# EasyEDA Pro project ProProject_开关电源实验平台_2024-07-17.epro, board PCB7
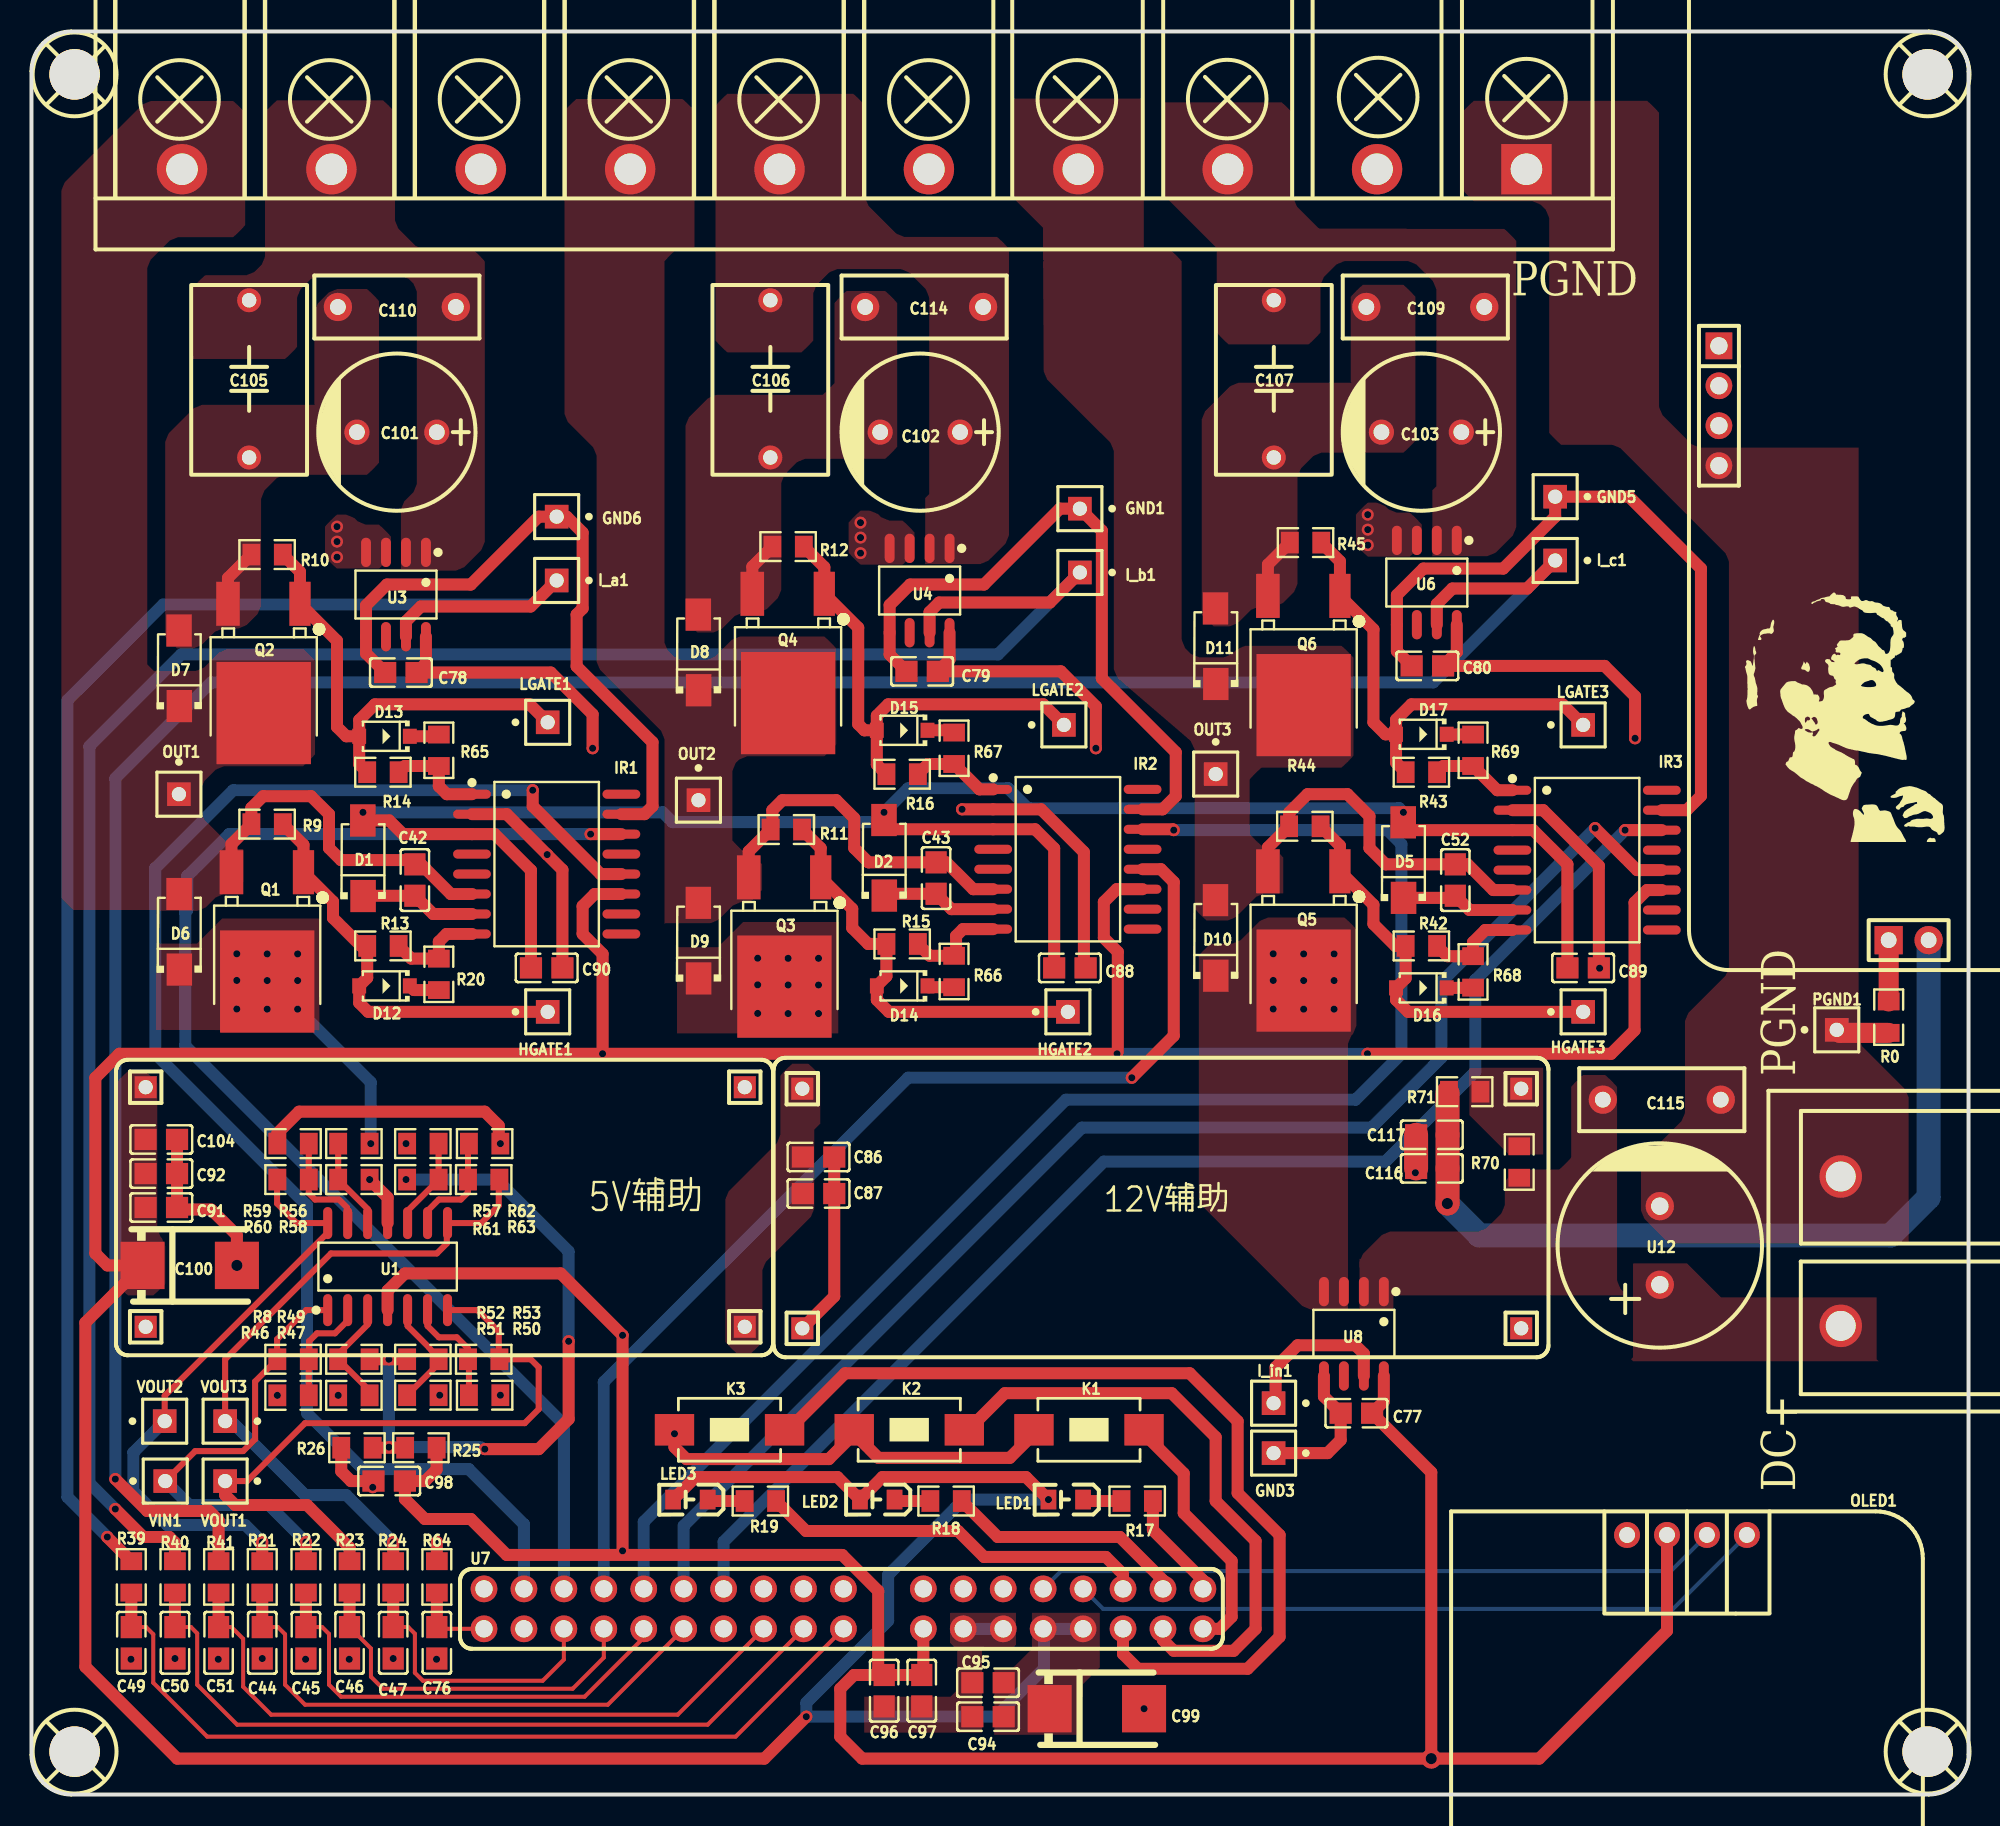
[diagram p0: board, top side]
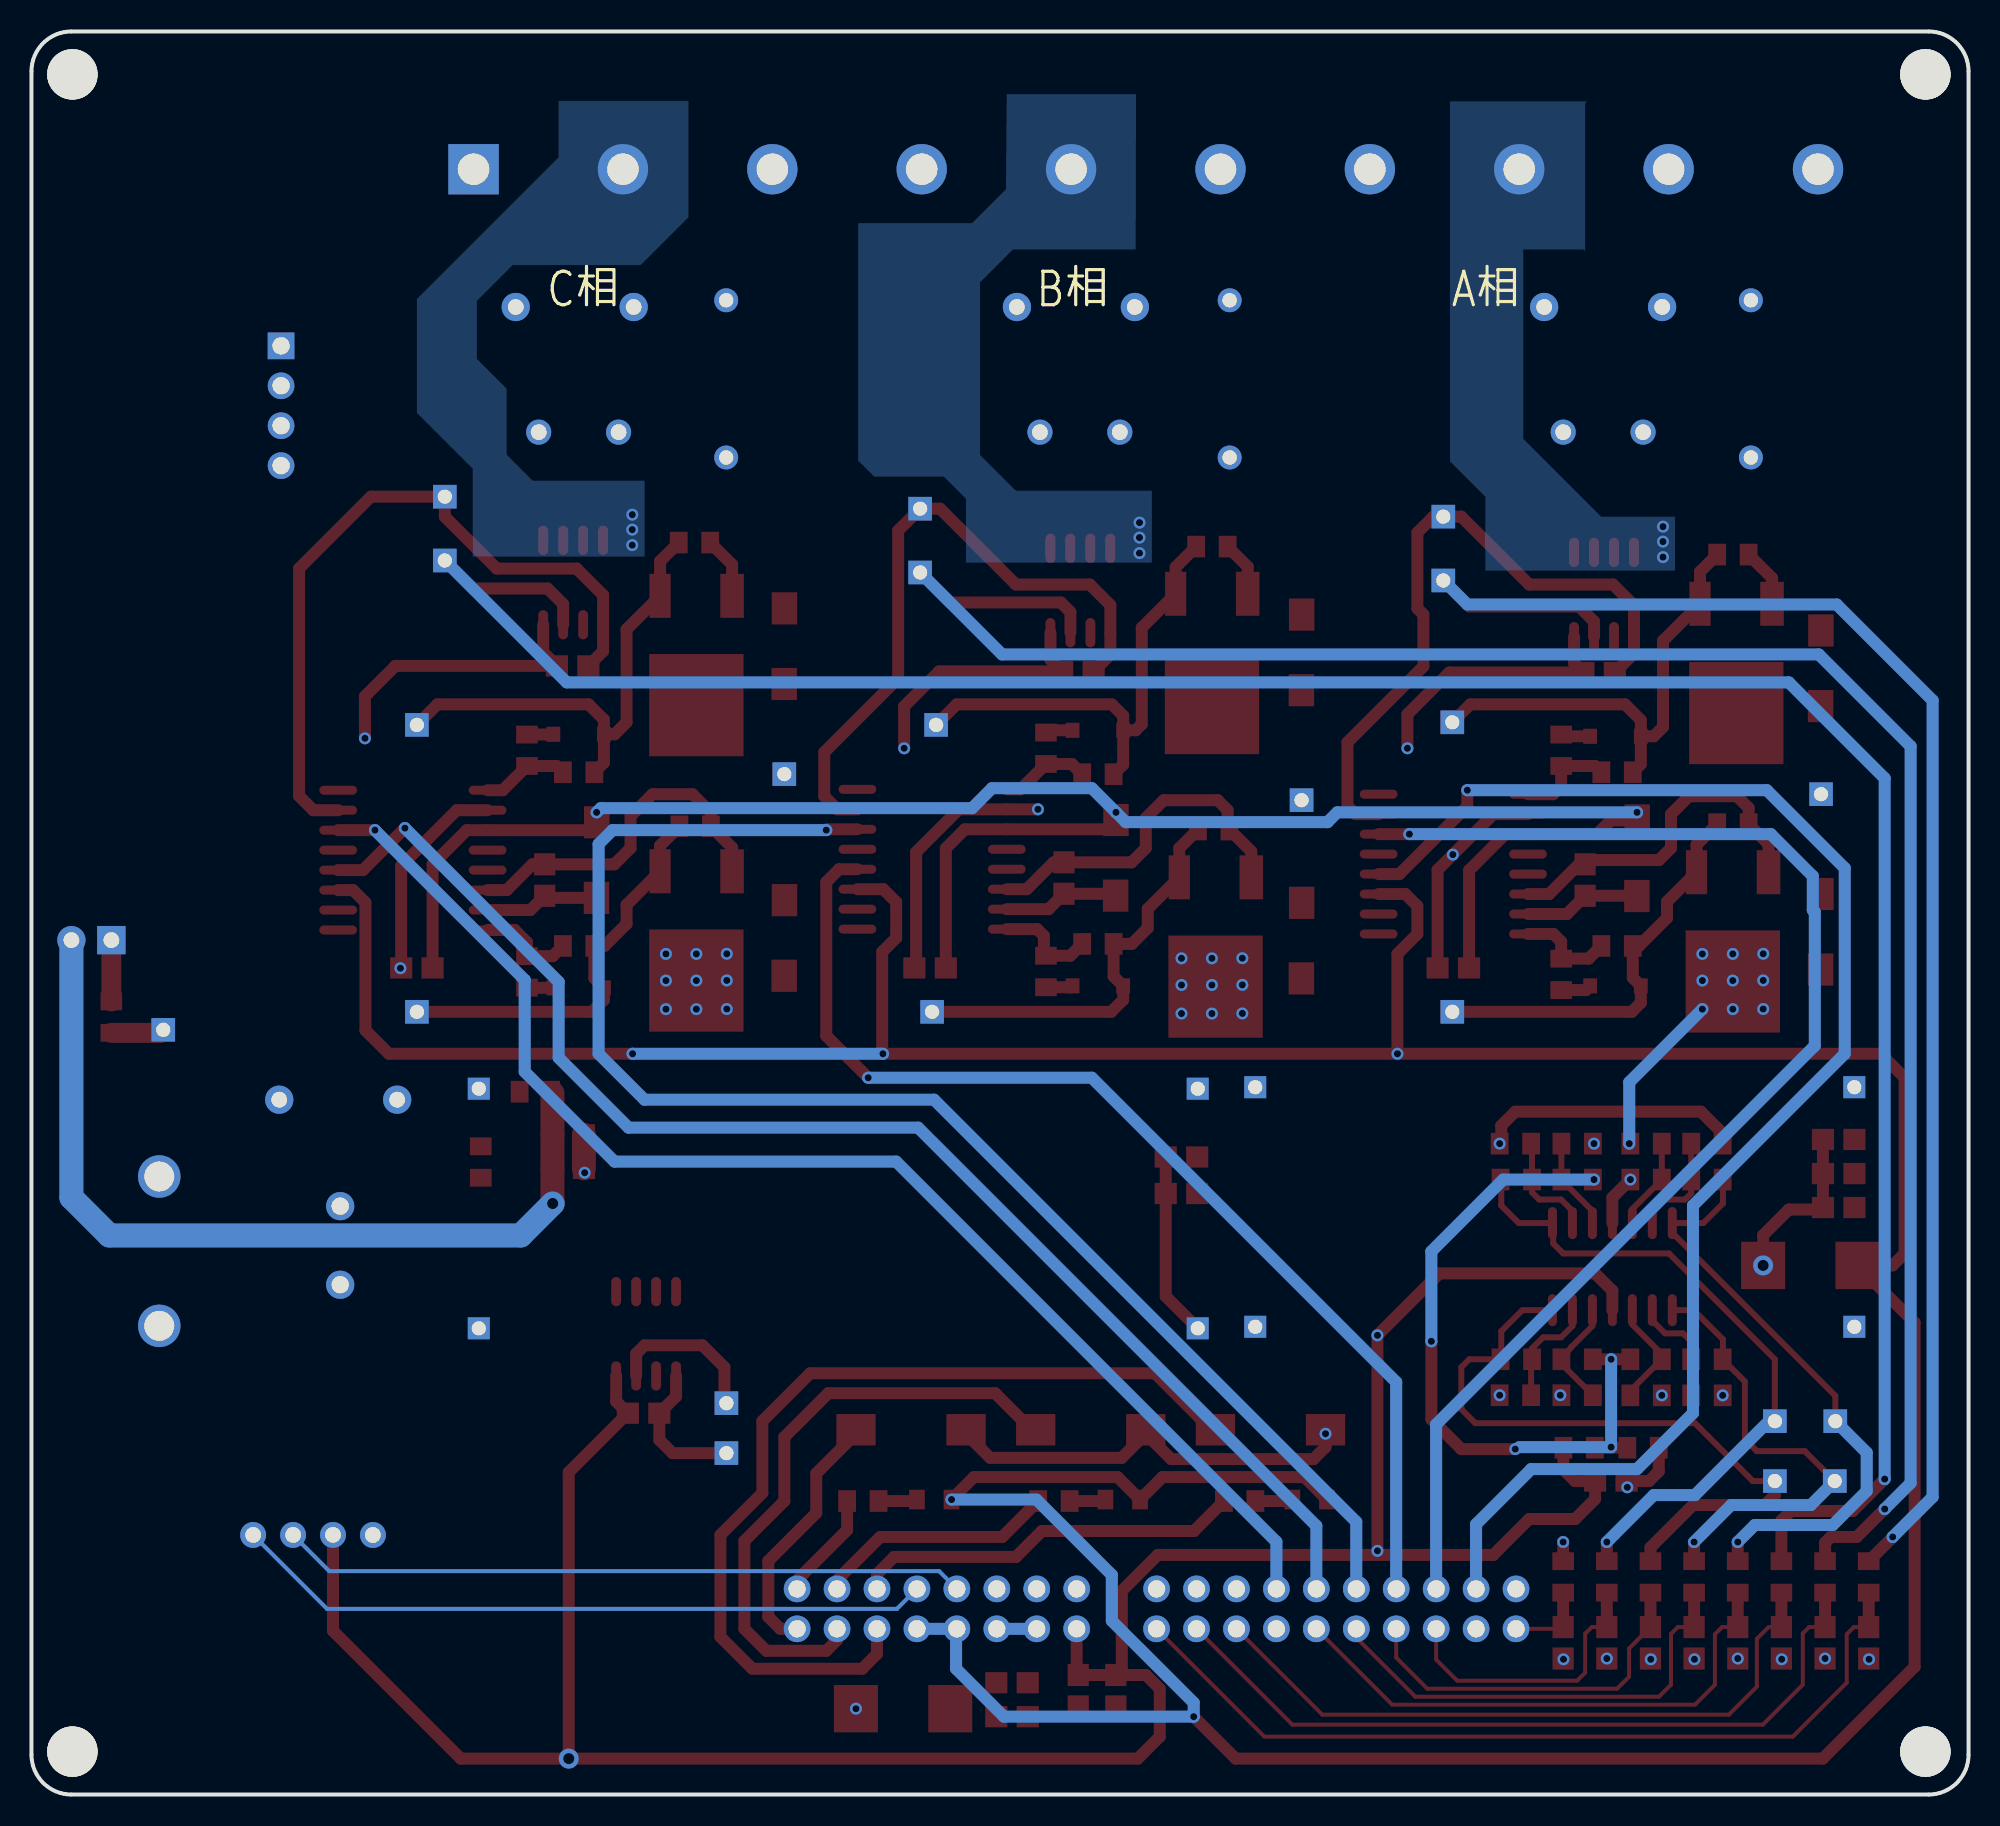
[diagram p1: board, bottom side, seen from below]

Outline 123.19 x 112.14 mm; copper layers: Top Layer, GND1, Inner2, PGND, GND, Bottom Layer. Coordinates in mm from the lower left corner of the outline.
Outline path: 0,109.6 0,2.54 arc(0.74,0.74) 2.54,0 120.65,0 arc(122.45,0.74) 123.19,2.54 123.19,109.6 arc(122.45,111.4) 120.65,112.14 2.54,112.14 arc(0.74,111.4) 0,109.6
Stack: Top Layer 0.035mm 外层铜厚1oz / Dielectric1 0.0994mm 3313 RC57% 4.2mil / GND1 0.0152mm 内层铜厚 / Dielectric2 0.55mm 0.55mm H/H不含铜 / Inner2 0.0152mm 内层铜厚 / Dielectric3 0.1088mm 2116 RC54% 4.9mil / PGND 0.0152mm 内层铜厚 / Dielectric4 0.55mm 0.55mm H/H不含铜 / GND 0.0152mm 内层铜厚 / Dielectric5 0.0994mm 3313 RC57% 4.2mil / Bottom Layer 0.035mm 外层铜厚1oz

## Design rules (mm)
template: JLCPCB Capability(Two Layers Board)
spacing copperThickness1oz (default): track to track 0.102, other pairs 0.152 to 0.3
spacing copperThickness2oz: track to track 0.203, other pairs 0.152 to 0.3
track width copperThickness1oz (default): min 0.127, default 0.254, max 2.54
track width copperThickness2oz: min 0.203, default 0.254, max 2.54
differential pair differentialPair (default): width min 0.127, default 0.254, max 2.54; gap min 0.152, default 0.152
via viaSize (default): diameter min 0.5, default 0.61, max 10; hole min 0.3, default 0.305, max 6.3

## Placement (name value [footprint] x y rotation side)
12V辅助  -  [12V辅助电源-LM5164]  72.52 38.29 180 top
C42  10uF  [c0805]  24.38 58.17 90 top
C43  10uF  [c0805]  57.53 58.29 90 top
C44  10nF  [c0805]  14.68 9.65 90 top
C45  10nF  [c0805]  17.45 9.65 90 top
C46  10nF  [c0805]  20.23 9.65 90 top
C47  10nF  [c0805]  23 9.65 90 top
C49  10nF  [c0805]  6.35 9.65 90 top
C50  10nF  [c0805]  9.13 9.65 90 top
C51  10nF  [c0805]  11.9 9.65 90 top
C52  10uF  [c0805]  90.55 58.17 90 top
C76  10nF  [c0805]  25.78 9.65 90 top
C77  100nF  [C0805]  84.26 24.26 0 top
C78  100nF  [C0805]  23.49 71.37 0 top
C79  100nF  [C0805]  56.64 71.44 0 top
C80  100nF  [C0805]  88.77 71.79 0 top
C86  100nF  [c0805]  50.05 40.55 180 top
C87  100nF  [c0805]  50.05 38.23 180 top
C88  100nF  [c0805]  66.04 52.58 180 top
C89  100nF  [c0805]  98.68 52.58 180 top
C90  100nF  [c0805]  32.77 52.58 180 top
C91  100nF  [c0805]  8.26 37.34 180 top
C92  100nF  [c0805]  8.26 39.5 180 top
C94  100nF  [c0805]  60.83 4.95 0 top
C95  100nF  [c0805]  60.83 7.11 0 top
C96  100nF  [c0805]  54.23 6.6 90 top
C97  100nF  [c0805]  56.62 6.6 90 top
C98  100nF  [c0805]  22.75 19.94 0 top
C99  22uF  [CASE-D_7343]  67.76 5.46 180 top
C100  22uF  [CASE-D_7343]  10.06 33.66 180 top
C101  220uF  [CAP-TH_BD10.0-P5.00-D1.0-FD]  23.24 86.66 180 top
C102  220uF  [CAP-TH_BD10.0-P5.00-D1.0-FD]  56.51 86.66 180 top
C103  220uF  [CAP-TH_BD10.0-P5.00-D1.0-FD]  88.39 86.66 180 top
C104  100nF  [c0805]  8.26 41.67 180 top
C105  1uF  [CAP-TH_L12.0-W7.1-P10.00-D0.6]  13.84 90.04 270 top
C106  1uF  [CAP-TH_L12.0-W7.1-P10.00-D0.6]  46.99 90.04 270 top
C107  1uF  [CAP-TH_L12.0-W7.1-P10.00-D0.6]  79.01 90.04 270 top
C109  100nF  [CAP-TH_L10.0-W4.0-P7.50-D0.8]  88.64 94.61 0 top
C110  100nF  [CAP-TH_L10.0-W4.0-P7.50-D0.8]  23.24 94.61 0 top
C114  100nF  [CAP-TH_L10.0-W4.0-P7.50-D0.8]  56.77 94.61 0 top
C115  100nF  [CAP-TH_L10.0-W4.0-P7.50-D0.8]  103.68 44.2 180 top
C116  100nF  [C0805]  89.06 39.83 0 top
C117  100nF  [C0805]  89.06 41.96 0 top
D1  SS510  [SMA_L4.3-W2.6-LS5.0-RD]  21.08 59.55 90 top
D2  SS510  [SMA_L4.3-W2.6-LS5.0-RD]  54.23 59.58 90 top
D5  SS510  [SMA_L4.3-W2.6-LS5.0-RD]  87.25 59.44 90 top
D6  SS510  [SMA_L4.3-W2.6-LS5.0-RD]  9.4 54.88 90 top
D7  SS510  [SMA_L4.3-W2.6-LS5.0-RD]  9.4 71.64 90 top
D8  SS510  [SMA_L4.3-W2.6-LS5.0-RD]  42.42 72.64 90 top
D9  SS510  [SMA_L4.3-W2.6-LS5.0-RD]  42.42 54.31 90 top
D10  SS510  [SMA_L4.3-W2.6-LS5.0-RD]  75.31 54.48 90 top
D11  SS510  [SMA_L4.3-W2.6-LS5.0-RD]  75.31 73.04 90 top
D12  1N4148W  [SOD-123_L2.7-W1.6-LS3.7-FD]  22.45 51.43 0 top
D13  1N4148W  [SOD-123_L2.7-W1.6-LS3.7-FD]  22.45 67.31 0 top
D14  1N4148W  [SOD-123_L2.7-W1.6-LS3.7-FD]  55.37 51.43 0 top
D15  1N4148W  [SOD-123_L2.7-W1.6-LS3.7-FD]  55.37 67.69 0 top
D16  1N4148W  [SOD-123_L2.7-W1.6-LS3.7-FD]  88.39 51.31 0 top
D17  1N4148W  [SOD-123_L2.7-W1.6-LS3.7-FD]  88.39 67.44 0 top
GND1  -  [hdr1x1]  66.67 81.79 270 top
GND3  -  [hdr1x1]  78.99 21.72 270 top
GND5  -  [hdr1x1]  96.9 82.55 270 top
GND6  -  [hdr1x1]  33.4 81.28 270 top
HGATE1  -  [hdr1x1]  32.83 49.78 90 top
HGATE2  -  [hdr1x1]  65.91 49.78 90 top
HGATE3  -  [hdr1x1]  98.68 49.78 90 top
I_a1  -  [hdr1x1]  33.4 77.22 270 top
I_b1  -  [hdr1x1]  66.67 77.73 270 top
I_c1  -  [hdr1x1]  96.9 78.49 270 top
I_in1  -  [hdr1x1]  78.99 24.89 270 top
IN1  DBT50B-9.5-2P-BK-P  [conn-th_dbt50b-9.5-2p]  115.06 34.56 90 top
IR1  IR2110STRPBF  [SOIC-16_L10.3-W7.5-P1.27-LS10.3-BL]  32.77 59.18 270 top
IR2  IR2110STRPBF  [SOIC-16_L10.3-W7.5-P1.27-LS10.3-BL]  65.91 59.49 270 top
IR3  IR2110STRPBF  [SOIC-16_L10.3-W7.5-P1.27-LS10.3-BL]  98.93 59.43 270 top
K1  -  [sw_pb2_a1]  67.31 23.2 90 top
K2  -  [sw_pb2_a1]  55.88 23.2 90 top
K3  -  [sw_pb2_a1]  44.45 23.2 90 top
LED1  -  [LED_0805]  65.73 18.77 180 top
LED2  -  [LED_0805]  53.74 18.77 180 top
LED3  -  [LED_0805]  41.85 18.77 180 top
LGATE1  -  [hdr1x1]  32.83 68.2 90 top
LGATE2  -  [hdr1x1]  65.66 68.03 90 top
LGATE3  -  [hdr1x1]  98.68 68.03 90 top
OLED1  -  [0.96OLED_4P]  105.28 16.51 0 top
OUT1  -  [hdr1x1]  9.38 63.63 0 top
OUT2  -  [hdr1x1]  42.42 63.25 0 top
OUT3  -  [hdr1x1]  75.31 64.91 0 top
PGND1  -  [hdr1x1]  114.81 48.64 90 top
Q1  NCEP0178AK  [TO-252-2_L6.5-W6.1-P4.58-LS10.0-TL]  15.01 55.19 270 top
Q2  NCEP0178AK  [TO-252-2_L6.5-W6.1-P4.58-LS10.0-TL]  14.79 72.26 270 top
Q3  NCEP0178AK  [TO-252-2_L6.5-W6.1-P4.58-LS10.0-TL]  47.9 54.86 270 top
Q4  NCEP0178AK  [TO-252-2_L6.5-W6.1-P4.58-LS10.0-TL]  48.13 72.9 270 top
Q5  NCEP0178AK  [TO-252-2_L6.5-W6.1-P4.58-LS10.0-TL]  80.92 55.25 270 top
Q6  NCEP0178AK  [TO-252-2_L6.5-W6.1-P4.58-LS10.0-TL]  80.92 72.77 270 top
R0  0  [R0805]  118.11 49.45 270 top
R8  10K  [R0805]  16.64 27.69 180 top
R9  10K  [R0805]  14.99 61.72 0 top
R10  10K  [R0805]  14.99 78.87 0 top
R11  10K  [R0805]  48.01 61.38 0 top
R12  10K  [R0805]  48.12 79.38 0 top
R13  20  [R0805]  22.35 53.97 180 top
R14  20  [R0805]  22.35 65.02 180 top
R15  20  [R0805]  55.37 54.1 180 top
R16  20  [R0805]  55.37 64.9 180 top
R17  510  [R0805]  70.32 18.67 0 top
R18  510  [R0805]  58.17 18.67 0 top
R19  510  [R0805]  46.35 18.67 0 top
R20  0  [R0805]  25.91 52.17 270 top
R21  10K  [R0805]  14.68 13.84 90 top
R22  10K  [R0805]  17.45 13.84 90 top
R23  10K  [R0805]  20.23 13.84 90 top
R24  10K  [R0805]  23 13.84 90 top
R25  10K  [R0805]  24.77 22.06 0 top
R26  10K  [R0805]  20.7 22.06 0 top
R39  10K  [R0805]  6.35 13.84 90 top
R40  10K  [R0805]  9.13 13.84 90 top
R41  10K  [R0805]  11.9 13.84 90 top
R42  20  [R0805]  88.39 53.97 180 top
R43  20  [R0805]  88.39 65.02 180 top
R44  10K  [R0805]  80.98 61.59 0 top
R45  10K  [R0805]  81.03 79.63 0 top
R46  300K  [R0805]  16.64 25.39 0 top
R47  300K  [R0805]  20.51 25.39 0 top
R49  10K  [R0805]  20.51 27.69 180 top
R50  300K  [R0805]  28.82 25.4 180 top
R51  300K  [R0805]  24.89 25.4 180 top
R52  10K  [R0805]  24.89 27.69 180 top
R53  10K  [R0805]  28.76 27.69 180 top
R56  300K  [R0805]  20.51 41.4 180 top
R57  300K  [R0805]  24.89 41.4 0 top
R58  10K  [R0805]  20.51 39.12 180 top
R59  300K  [R0805]  16.64 41.4 0 top
R60  10K  [R0805]  16.64 39.12 180 top
R61  10K  [R0805]  24.89 39.12 0 top
R62  300K  [R0805]  28.82 41.4 180 top
R63  10K  [R0805]  28.76 39.12 0 top
R64  10K  [R0805]  25.78 13.84 90 top
R65  0  [R0805]  25.91 66.42 90 top
R66  0  [R0805]  58.67 52.35 270 top
R67  0  [R0805]  58.67 66.55 90 top
R68  0  [R0805]  91.68 52.32 270 top
R69  0  [R0805]  91.68 66.42 90 top
R70  0  [R0805]  94.62 40.23 270 top
R71  0  [R0805]  91.15 44.7 180 top
SCREW1  -  [M3螺丝]  120.65 2.79 90 top
SCREW2  -  [M3螺丝]  2.81 2.79 90 top
SCREW3  -  [M3螺丝]  2.81 109.47 90 top
SCREW4  -  [M3螺丝]  120.65 109.47 90 top
U1  SGM8634XS14/TR  [SOIC-14_L8.7-W3.9-P1.27-LS6.0-BL]  22.65 33.58 0 top
U3  CC6903SO-10A  [SOP-8_L4.9-W3.9-P1.27-LS6.0-BL]  23.18 76.33 180 top
U4  CC6903SO-10A  [SOP-8_L4.9-W3.9-P1.27-LS6.0-BL]  56.48 76.58 180 top
U5  -  [5V辅助电源-SY8401]  24.77 37.21 180 top
U6  CC6903SO-10A  [SOP-8_L4.9-W3.9-P1.27-LS6.0-BL]  88.74 77.09 180 top
U7  -  [竖插功率接口]  51.77 11.68 0 top
U8  CC6903SO-10A  [SOP-8_L4.9-W3.9-P1.27-LS6.0-BL]  84.1 29.31 180 top
U9  -  [单/三相整流桥]  121.79 81.4 0 top
U11  HB9500-9.5-10P  [CONN-TH_HB9500-9.5-10P]  52.32 103.38 180 top
U12  220uF  [CAP-TH_BD13.0-P5.00-D0.6-FD]  103.56 34.92 90 top
VIN1  -  [hdr1x1]  8.51 19.94 90 top
VOUT1  -  [hdr1x1]  12.32 19.94 270 top
VOUT2  -  [hdr1x1]  8.47 23.75 90 top
VOUT3  -  [hdr1x1]  12.32 23.75 270 top

## Footprints (pads in the part's own frame, mm; a bottom-side part is the same pattern mirrored in y, then rotated)
0.96OLED_4P
  round 1.65 hole 1: 1(-3.81,-0.002) 2(-1.27,0.002) 3(1.27,0.002) 4(3.81,0.002)
5V辅助电源-SY8401
  rect 1.4x1.4 hole 0.9: 1(-20.599,7.46) 2(-20.599,-7.78) 3(17.5,-7.78) 4(17.5,7.46)
12V辅助电源-LM5164
  rect 1.4x1.4 hole 0.9: 1(-22.225,-6.604) 2(-22.225,8.636) 3(23.495,-6.604) 4(23.495,8.636)
c0805
  rect 1.41x1.35 smd: 1(-1,0) 2(1,0)
C0805
  rect 1.41x1.35 smd: 1(-1,0) 2(1,0)
CAP-TH_BD10.0-P5.00-D1.0-FD
  round 1.6 hole 1: 1(-2.54,0) 2(2.54,0)
CAP-TH_BD13.0-P5.00-D0.6-FD
  round 1.8 hole 1.1: 1(-2.5,0) 2(2.5,0)
CAP-TH_L10.0-W4.0-P7.50-D0.8
  round 1.8 hole 1: 1(-3.75,0) 2(3.75,0)
CAP-TH_L12.0-W7.1-P10.00-D0.6
  round 1.524 hole 0.914: 1(-5,0) 2(5,0)
CASE-D_7343
  rect 2.799x3.01 smd: 1(3,0) 2(-3,0)
conn-th_dbt50b-9.5-2p
  round 2.7 hole 1.9: 1(-4.75,0) 2(4.75,0)
CONN-TH_HB9500-9.5-10P
  rect 3.21x3.2 hole 2: 1(-42.75,0)
  round 3.2 hole 2: 2(-33.25,0) 3(-23.75,0) 4(-14.25,0) 5(-4.75,0) 6(4.75,0) 7(14.25,0) 8(23.75,0) 9(33.25,0) 10(42.75,0)
hdr1x1
  rect 1.5x1.5 hole 0.9: 1(0,0)
LED_0805
  rect 1x1.25 smd: 1(-1.15,0.005) 2(1.05,0.005)
M3螺丝
  round 3.2 hole 3.2: 1(-0.064,0.064)
R0805
  rect 1.133x1.377 smd: 1(-1,0) 2(1,0)
SMA_L4.3-W2.6-LS5.0-RD
  rect 2.046x1.62 smd: 1(-2.404,-0.009) 2(2.404,0.009)
SOD-123_L2.7-W1.6-LS3.7-FD
  rect 0.88x0.96 smd: 1(-1.61,0) 2(1.61,0)
SOIC-14_L8.7-W3.9-P1.27-LS6.0-BL
  oval 0.574x2.038 smd: 1(-3.81,-2.769) 2(-2.54,-2.769) 3(-1.27,-2.769) 4(0,-2.769) 5(1.27,-2.769) 6(2.54,-2.769) 7(3.81,-2.769) 8(3.81,2.769) 9(2.54,2.769) 10(1.27,2.769) 11(0,2.769) 12(-1.27,2.769) 13(-2.54,2.769) 14(-3.81,2.769)
SOIC-16_L10.3-W7.5-P1.27-LS10.3-BL
  oval 0.574x2.401 smd: 1(-4.445,-4.75) 2(-3.175,-4.75) 3(-1.905,-4.75) 4(-0.635,-4.75) 5(0.635,-4.75) 6(1.905,-4.75) 7(3.175,-4.75) 8(4.445,-4.75) 9(4.445,4.75) 10(3.175,4.75) 11(1.905,4.75) 12(0.635,4.75) 13(-0.635,4.75) 14(-1.905,4.75) 15(-3.175,4.75) 16(-4.445,4.75)
SOP-8_L4.9-W3.9-P1.27-LS6.0-BL
  oval 0.63x1.865 smd: 1(-1.905,-2.683) 2(-0.635,-2.683) 3(0.635,-2.683) 4(1.905,-2.683) 5(1.905,2.683) 6(0.635,2.683) 7(-0.635,2.683) 8(-1.905,2.683)
sw_pb2_a1
  rect 2x2.5 smd: 1(0,3.556) 2(0,-3.444)
TO-252-2_L6.5-W6.1-P4.58-LS10.0-TL
  rect 2.8x1.35 smd: 1(-3.475,2.29)
  rect 2.8x1.5 smd: 3(-3.475,-2.29)
  rect 6.5x6 smd: 4(3.475,-0.017)
单/三相整流桥
  rect 1.7x1.7 hole 1.1: 1(-14.478,10.748)
  round 1.7 hole 1.1: 2(-14.478,8.208) 3(-14.478,5.668) 4(-14.478,3.128)
  rect 1.8x1.8 hole 1: 5(-3.683,-27.051)
  round 1.8 hole 1: 6(-1.143,-27.051)
竖插功率接口
  round 1.7 hole 1.1: 1(-22.987,-1.143) 2(-20.447,-1.143) 3(-17.907,-1.143) 4(-15.367,-1.143) 5(-12.827,-1.143) 6(-10.287,-1.143) 7(-7.747,-1.143) 8(-5.207,-1.143) 9(-2.667,-1.143) 10(-0.127,-1.143) 11(-22.987,1.397) 12(-20.447,1.397) 13(-17.907,1.397) 14(-15.367,1.397) 15(-12.827,1.397) 16(-10.287,1.397) 17(-7.747,1.397) 18(-5.207,1.397) 19(-2.667,1.397) 20(-0.127,1.397) 21(4.953,-1.143) 22(7.493,-1.143) 23(10.033,-1.143) 24(12.573,-1.143) 25(15.113,-1.143) 26(4.953,1.397) 27(7.493,1.397) 28(10.033,1.397) 29(12.573,1.397) 30(15.113,1.397) 41(17.653,-1.143) 42(20.193,-1.143) 43(22.733,-1.143) 44(17.653,1.397) 45(20.193,1.397) 46(22.733,1.397)

## Nets
+3.3V: C77.2 C78.2 C79.2 C80.2 C96.2 C97.2 C98.2 OLED1.2 R25.2 U1.4 U3.8 U4.8 U6.8 U7.21 U8.8
+5V: C91.2 C92.2 C94.2 C95.2 C99.1 C100.1 C104.2 IR1.11 IR2.11 IR3.11 LED1.2 LED2.2 LED3.2 U5.3 U7.24 U7.25
+12V: 12V辅助.3 C86.2 C87.2 C88.2 C89.2 C90.2 D1.2 D2.2 D5.2 IR1.3 IR2.3 IR3.3 U5.1
GND: 12V辅助.2 12V辅助.4 C44.1 C45.1 C46.1 C47.1 C49.1 C50.1 C51.1 C76.1 C77.1 C78.1 C79.1 C80.1 C86.1 C87.1 C91.1 C92.1 C94.1 C95.1 C96.1 C97.1 C98.1 C99.2 C100.2 C104.1 C116.1 C117.1 GND1.1 GND3.1 GND5.1 GND6.1 IR1.15 IR2.15 IR3.15 K1.1 K2.1 K3.1 OLED1.1 R0.1 R26.1 R58.1 U1.11 U3.5 U4.5 U5.2 U5.4 U6.5 U7.22 U7.23 U8.5 U9.5
PGND: C88.1 C89.1 C90.1 C101.2 C102.2 C103.2 C105.2 C106.2 C107.2 C109.1 C110.1 C114.1 C115.1 D7.2 D8.2 D11.2 IN1.2 IR1.2 IR2.2 IR3.2 PGND1.1 Q2.3 Q4.3 Q6.3 R0.2 R10.1 R12.1 R45.1 R46.1 R50.1 R59.1 R62.1 U9.4 U11.1 U12.2
VIN: D6.1 D9.1 D10.1 Q1.4 Q3.4 Q5.4 R56.1 U8.3 U8.4
+DC: C115.2 IN1.1 R70.2 U8.1 U8.2 U12.1
ADOUT1: C44.2 R21.1 U7.6
ADOUT2: C45.2 R22.1 U7.5
ADOUT3: C46.2 R23.1 U7.4
ADOUT4: C47.2 R24.1 U7.3
ADOUT5: C49.2 R39.1 U7.10
ADOUT6: C50.2 R40.1 U7.9
ADOUT7: C51.2 R41.1 U7.8
ADOUT8: C76.2 R64.1 U7.1
H1: D12.1 HGATE1.1 Q1.1 R9.2 R13.2
H2: D14.1 HGATE2.1 Q3.1 R11.2 R15.2
H3: D16.1 HGATE3.1 Q5.1 R42.2 R44.2
I2C_SCL: OLED1.3 U7.29
I2C_SDA: OLED1.4 U7.30
IOUT1: C101.1 C105.1 C110.2 R47.1 U3.1 U3.2 U11.9
IOUT2: C102.1 C106.1 C114.2 R51.1 U4.1 U4.2 U11.6
IOUT3: C103.1 C107.1 C109.2 R57.1 U6.1 U6.2 U11.3
IOUT_1: U3.3 U3.4 U9.1 U11.8
IOUT_2: U4.3 U4.4 U9.2 U11.5
IOUT_3: U6.3 U6.4 U9.3 U11.2
KEY1: K1.2 U7.43
KEY2: K2.2 U7.42
KEY3: K3.2 U7.41
L1: D13.1 LGATE1.1 Q2.1 R10.2 R14.2
L2: D15.1 LGATE2.1 Q4.1 R12.2 R16.2
L3: D17.1 LGATE3.1 Q6.1 R43.2 R45.2
LED1: R17.2 U7.46
LED2: R18.2 U7.45
LED3: R19.2 U7.44
OUT1: C42.2 D6.2 D7.1 IR1.6 OUT1.1 Q1.3 Q2.4 R9.1 U11.10
OUT2: C43.2 D8.1 D9.2 IR2.6 OUT2.1 Q3.3 Q4.4 R11.1 U11.7
OUT3: C52.2 D10.2 D11.1 IR3.6 OUT3.1 Q5.3 Q6.4 R44.1 U11.4
PADOUT1: R21.2 R60.2 U1.14 VOUT2.1
PADOUT2: R8.2 R22.2 U1.1 VIN1.1
PADOUT3: R23.2 R53.1 U1.7 VOUT1.1
PADOUT4: R24.2 R63.2 U1.8 VOUT3.1
PADOUT5: I_a1.1 R39.2 U3.7
PADOUT6: I_b1.1 R40.2 U4.7
PADOUT7: I_c1.1 R41.2 U6.7
PADOUT8: I_in1.1 R64.2 U8.7
PWM1A: IR1.12 U7.12
PWM1B: IR1.14 U7.13
PWM2A: IR2.12 U7.14
PWM2B: IR2.14 U7.15
PWM3A: IR3.12 U7.16
PWM3B: IR3.14 U7.17
REF_1V65: R25.1 R26.2 R49.1 R52.2 R61.1
SPWMH1: IR1.8 R13.1 R20.1
SPWMH2: IR2.8 R15.1 R66.1
SPWMH3: IR3.8 R42.1 R68.1
SPWML1: IR1.1 R14.1 R65.1
SPWML2: IR2.1 R16.1 R67.1
SPWML3: IR3.1 R43.1 R69.1
VA: 12V辅助.1 R70.1 R71.1
VOUT: C116.2 C117.2 R71.2 U9.6
$1N217: R47.2 R49.2 U1.3
$1N317: R8.1 R46.2 U1.2
$1N465: R51.2 R52.1 U1.5
$1N509: R50.2 R53.2 U1.6
$1N654: R56.2 R58.2 U1.12
$1N682: R59.2 R60.1 U1.13
$1N827: R57.2 R61.2 U1.10
$1N856: R62.2 R63.1 U1.9
$1N4259: C42.1 D1.1 IR1.7
$1N4274: C43.1 D2.1 IR2.7
$1N4289: C52.1 D5.1 IR3.7
$1N4373: D12.2 R20.2
$1N4452: D13.2 R65.2
$1N4604: D14.2 R66.2
$1N4683: D15.2 R67.2
$1N4762: D16.2 R68.2
$1N4841: D17.2 R69.2
$1N5237: LED1.1 R17.1
$1N5238: LED2.1 R18.1
$1N5239: LED3.1 R19.1

Pads without a net: IR1 4 5 9 10 13 16; IR2 4 5 9 10 13 16; IR3 4 5 9 10 13 16; SCREW1 1; SCREW2 1; SCREW3 1; SCREW4 1; U3 6; U4 6; U6 6; U7 2 7 11 18 19 20 26 27 28; U8 6

## Via types
v1: diameter 0.762, hole 0.457, Top Layer to Bottom Layer, 90 vias
v2: diameter 1.27, hole 0.711, Top Layer to Bottom Layer, 3 vias

## Routing (per net, layer and track width the routed paths; a pad name or vN(x,y) marks a point on that pad's centre or on a via; arc(x,y) is an arc through that point)
+3.3V: length 332.1
  Top Layer w0.762: U4.8 58.39,72.19 C79.2 65.47,71.44 67.69,69.21 v1(67.69,66.55) ; v2(89.02,2.29) 52.83,2.29 51.44,3.68 51.44,6.73 52.31,7.6 C96.2 ; v2(89.02,2.29) 89.02,20.5 C77.2 86,25 U8.8 ; v2(89.02,2.29) 95.88,2.29 104.01,10.41 OLED1.2 ; U7.21 56.72,7.7 C97.2 C96.2 ; U1.4 22.65,32.05 23.75,33.15 33.66,33.15 v1(37.59,29.21) v1(37.59,15.5) ; C96.2 53.85,7.98 53.85,12.95 51.56,15.24 30.23,15.24 27.94,17.53 25.02,17.53 23.75,18.8 23.75,19.94 C98.2 25.03,19.94 25.77,20.67 R25.2 ; U6.8 90.65,72.66 C80.2 100.04,71.79 101.98,69.85 v1(101.98,67.18) ; v1(35.69,66.55) 35.69,68.71 33.03,71.37 C78.2 25.09,71.96 U3.8
  Inner2 w0.762: v1(101.98,67.18) 101.35,66.55 v1(67.69,66.55) v1(35.69,66.55) 35.69,63.88 37.23,62.33 37.23,29.44 37.59,29.08
+5V: length 296.7
  Top Layer w0.762: v1(64.68,18.76) 63.25,20.19 54.12,20.19 52.69,18.76 51.26,20.19 42.23,20.19 40.8,18.76 ; 36.32,47.12 36.32,53.47 35.05,54.74 35.05,56.52 35.81,57.28 IR1.11 ; 36.32,47.12 v1(36.32,47.12) 5.59,47.12 4.06,45.59 4.06,34.42 4.83,33.66 C100.1 3.43,30.02 3.43,8.13 9.27,2.29 46.61,2.29 v1(49.28,4.95) ; 36.32,47.12 36.33,47.12 v1(69.04,47.12) ; v1(84.96,47.12) 100.46,47.12 101.95,48.61 101.95,56.74 102.74,57.53 IR3.11 ; IR2.11 69.01,57.58 68.2,56.77 68.2,54.48 69.09,53.59 69.09,47.24
  Bottom Layer w0.762: v1(64.68,18.76) 59.28,18.76 54.48,13.97 54.48,11.05 49.28,5.84 v1(49.28,4.95) 61.34,4.95 64.39,8 64.39,10.49 U7.24 U7.25 ; v1(84.96,47.12) v1(69.04,47.12)
+12V: length 143.2
  Top Layer w0.762: D2.2 54.81,61.39 IR2.3 63.83,61.39 65.04,60.18 C88.2 ; C90.2 31.77,58.78 29.46,61.09 IR1.3 23.62,61.09 22.75,61.96 D1.2 ; D5.2 87.74,61.34 IR3.3 95.51,61.34 97.68,59.17 C89.2
  Inner2 w0.762: 12V辅助.3 54.22,50.09 v1(54.22,62.47)
  Bottom Layer w0.762: v1(21.08,62.47) 40.14,62.47 40.77,61.85 53.6,61.85 v1(54.22,62.47) 55.75,64.01 62.1,64.01 63.37,62.74 86.98,62.74 v1(87.25,62.47)
GND: length 205.6
  Top Layer w0.762: v1(40.89,22.95) 40.89,22.1 41.66,21.34 50.71,21.34 52.32,22.95 53.86,21.42 62.22,21.42 63.75,22.95 ; C79.1 54.58,72.51 U4.5 54.58,75.66 55.88,76.96 60.58,76.96 65.41,81.79 GND1.1 68.07,80.39 68.07,70.99 72.77,66.29 72.77,63.5 71.94,62.66 IR2.15 ; 12V辅助.4 51.05,31.69 C87.1 C86.1 ; C104.1 C92.1 C91.1 9.39,37.21 11.43,37.21 13.06,35.58 v2(13.06,33.66) ; C78.1 21.28,72.58 U3.5 21.28,75.63 22.61,76.96 27.94,76.96 32.26,81.28 GND6.1 34.04,81.28 35.05,80.26 35.05,75.44 34.67,75.06 34.67,71.75 39.5,66.93 39.5,62.86 38.99,62.36 IR1.15 ; C98.1 20.32,19.94 19.7,20.56 R26.1 ; U1.11 22.65,37.97 v1(21.51,39.12) ; IR3.15 105.26,62.61 106.17,63.52 106.17,77.98 101.6,82.55 GND5.1 96.9,81.28 93.6,77.98 88.52,77.98 86.84,76.29 U6.5 86.84,72.72 C80.1 ; GND3.1 82.42,21.72 83.26,22.55 C77.1 82.19,25.32 U8.5
  Top Layer w1.27: R0.1 U9.5
  Top Layer w1.524: C117.1 C116.1
  Bottom Layer w0.762: U7.23 U7.22
  vias: v1(6.33,8.6) v1(9.13,8.65) v1(11.88,8.6) v1(14.68,8.65) v1(17.43,8.6) v1(20.21,8.6) v1(21.7,19.54) v1(23,8.65) v1(25.76,8.6) v1(70.76,5.46) v1(88.01,39.55)
PGND: length 74.7
  Top Layer w0.762: R10.1 12.5,77.38 Q2.3 ; R45.1 78.63,78.24 Q6.3 ; IR3.2 96.14,62.61 99.68,59.07 C89.1 ; R59.1 15.64,42.05 17.02,43.43 28.83,43.43 29.72,42.54 29.72,41.5 v1(29.82,41.4) ; Q4.3 45.84,78.1 R12.1 ; IR1.2 30.23,62.36 v1(32.8,59.79) 33.77,58.82 C90.1 ; v1(59.18,62.66) IR2.2 64.21,62.66 66.93,59.94 66.93,52.69 C88.1
  Top Layer w1.27: R0.2 115,48.45 PGND1.1
  vias: v1(15.64,25.39) v1(29.82,25.4) v1(99.73,52.56)
VIN: length 10.5
  Bottom Layer w0.762: v1(21.58,41.4) 21.58,45.3 v1(16.93,49.96)
  vias: v1(13.06,53.48) v1(13.06,51.78) v1(13.06,49.96) v1(14.99,53.47) v1(14.99,51.77) v1(14.99,49.96) v1(16.93,53.47) v1(16.93,51.77) v1(46.18,53.19) v1(46.18,51.5) v1(46.18,49.68) v1(48.12,53.19) v1(48.12,51.49) v1(48.12,49.67) v1(50.05,53.19) v1(50.05,51.49) v1(50.05,49.67) v1(78.97,53.48) v1(78.97,51.78) v1(78.97,49.96) v1(80.91,53.47) v1(80.91,51.77) v1(80.91,49.95) v1(82.84,53.47) v1(82.84,51.77) v1(82.84,49.95)
ADOUT1: length 34.9
  Top Layer w0.254: U7.6 36.65,5.72 17.4,5.72 16.13,6.98 16.13,10.2 15.67,10.65 C44.2
  Top Layer w0.762: C44.2 R21.1
ADOUT2: length 29.5
  Top Layer w0.254: U7.5 38.94,9.98 35.18,6.22 19.69,6.22 18.92,6.98 18.92,10.22 18.49,10.65 C45.2
  Top Layer w0.762: C45.2 R22.1
ADOUT3: length 23.7
  Top Layer w0.254: U7.4 36.4,8.71 34.42,6.73 22.35,6.73 21.59,7.49 21.59,9.29 C46.2
  Top Layer w0.762: C46.2 R23.1
ADOUT4: length 18.4
  Top Layer w0.254: U7.3 33.86,8.59 32.51,7.24 24.89,7.24 24.38,7.75 24.38,10.23 23.96,10.65 C47.2
  Top Layer w0.762: C47.2 R24.1
ADOUT5: length 55
  Top Layer w0.254: C49.2 7.29,10.65 7.75,10.2 7.75,7.11 11.18,3.68 44.78,3.68 U7.10
  Top Layer w0.762: C49.2 R39.1
ADOUT6: length 49.2
  Top Layer w0.254: U7.9 43,4.44 13.08,4.44 10.54,6.98 10.54,10.25 10.14,10.65 C50.2
  Top Layer w0.762: C50.2 R40.1
ADOUT7: length 43.2
  Top Layer w0.254: C51.2 12.72,10.65 13.46,9.91 13.46,6.86 15.24,5.08 41.1,5.08 U7.8
  Top Layer w0.762: C51.2 R41.1
ADOUT8: length 5.2
  Top Layer w0.254: U7.1 25.89,10.54 C76.2
  Top Layer w0.762: C76.2 R64.1
H1: length 26.3
  Top Layer w0.762: HGATE1.1 21.42,49.78 20.84,50.36 D12.1 21.35,51.94 R13.2 20.95,53.97 19.18,55.75 19.18,56.79 Q1.1 17.3,60.41 R9.2
H2: length 26.5
  Top Layer w0.762: R11.2 50.19,60.19 50.19,58.34 52.2,56.33 52.2,55.12 53.21,54.1 R15.2 54.37,52.04 53.76,51.43 53.76,50.55 54.52,49.78 HGATE2.1
H3: length 26.1
  Top Layer w0.762: R44.2 83.21,60.35 Q5.1 85.34,56.59 85.34,55.37 86.74,53.97 R42.2 87.39,51.92 D16.1 86.78,50.55 87.54,49.78 HGATE3.1
I2C_SCL: length 43.6
  Bottom Layer w0.254: OLED1.3 104.25,14.21 65.47,14.21 U7.29
I2C_SDA: length 44.7
  Bottom Layer w0.254: OLED1.4 104.39,11.81 68.15,11.81 U7.30
IOUT1: length 79.3
  Inner2 w0.762: v1(19.51,25.39) 19.51,75.87 17.65,77.72 17.65,101.96 19.07,103.38
IOUT2: length 106.6
  Inner2 w0.762: U11.6 44.02,106.93 27.56,106.93 25.15,104.52 25.15,92.58 28.7,89.03 28.7,28.14 v1(25.96,25.4)
IOUT3: length 121.7
  Inner2 w0.762: v1(23.82,41.4) 23.37,41.85 23.37,106.04 27.05,109.73 69.72,109.73 U11.3
IOUT_1: length 85.7
  Inner2 w1.524: U9.1 36,92.14 28.45,99.69 28.45,103.25 28.57,103.38
  vias: v1(19.43,80.64) v1(19.43,79.69) v1(19.43,78.71)
IOUT_2: length 68.9
  Inner2 w1.524: U11.5 56.9,103.2 56.9,99.95 59.56,97.28 109.6,97.28 111.38,95.5 111.38,91.06 109.92,89.6 U9.2
  vias: v1(52.72,80.9) v1(52.72,79.95) v1(52.72,78.96)
IOUT_3: length 47.4
  Inner2 w1.524: U11.2 88.62,100.33 112.14,100.33 114.55,97.92 114.55,90.3 111.32,87.06 U9.3
  vias: v1(84.98,81.41) v1(84.98,80.45) v1(84.98,79.47)
KEY1: length 16.1
  Top Layer w0.762: U7.43 75.56,10.54 76.33,11.3 76.33,14.86 73.28,17.91 73.28,20.42 70.75,22.95
KEY2: length 38.9
  Top Layer w0.762: 59.32,22.95 61.9,25.53 72.52,25.53 75.31,22.73 75.31,18.67 77.85,16.13 77.85,10.54 76.45,9.14 72.64,9.14 71.96,9.83 U7.42
KEY3: length 59.2
  Top Layer w0.762: 47.89,23.2 48.15,23.2 51.74,26.8 73.66,26.8 76.71,23.75 76.71,19.18 79.38,16.51 79.38,10.03 77.34,8 70.36,8 69.42,8.94 U7.41
L1: length 30.5
  Top Layer w0.762: R14.2 20.84,65.53 D13.1 ; LGATE1.1 31.69,69.34 21.84,69.34 20.84,68.34 D13.1 ; R10.2 17.08,77.78 Q2.1 19.43,73.38 19.43,67.9 20.02,67.31 D13.1
L2: length 30.8
  Top Layer w0.762: R12.2 50.42,78.07 Q4.1 52.58,74.22 52.58,68.08 52.97,67.69 53.76,67.69 ; LGATE2.1 64.35,69.34 54.48,69.34 53.76,68.62 53.76,67.69 ; R16.2 53.76,65.51 53.76,67.69
L3: length 31
  Top Layer w0.762: R43.2 86.78,65.63 D17.1 ; D17.1 86.11,67.44 85.34,68.2 85.34,74.11 Q6.1 83.21,78.44 R45.2 ; D17.1 86.78,68.37 87.76,69.34 97.37,69.34 LGATE3.1
LED1: length 6.9
  Top Layer w0.762: U7.46 74.5,13.64 71.32,16.82 R17.2
LED2: length 15.4
  Top Layer w0.762: R18.2 61.45,16.38 69.22,16.38 71.96,13.64 U7.45
LED3: length 24.9
  Top Layer w0.762: U7.44 69.42,14.02 68.33,15.11 60.58,15.11 58.93,16.76 49.26,16.76 R19.2
OUT1: length 22.8
  Top Layer w0.762: IR1.6 26.67,57.28 24.78,59.17 C42.2 24.11,59.44 19.69,59.44 18.92,60.2 18.92,62.36 17.78,63.5 14.73,63.5 13.99,62.75 R9.1 12.72,60.46 Q1.3
OUT2: length 22.7
  Top Layer w0.762: 45.61,58.34 45.61,59.99 R11.1 47.12,61.49 47.12,62.61 47.75,63.25 51.18,63.25 52.32,62.1 52.32,60.2 53.23,59.29 C43.2 58.18,59.29 59.89,57.58 IR2.6
OUT3: length 22.7
  Top Layer w0.762: IR3.6 92.97,57.53 91.33,59.17 C52.2 86.12,59.17 85.09,60.2 85.09,62.23 83.69,63.63 81.15,63.63 79.98,62.46 R44.1 78.63,60.24 Q5.3
PADOUT1: length 38.2
  Top Layer w0.381: R60.2 15.62,39.1 15.62,37.59 16.86,36.35 U1.14 18.84,35.73 8.47,25.36 VOUT2.1
  Top Layer w0.762: R21.2 v1(14.68,16.06)
  Bottom Layer w0.762: v1(14.68,16.06) 13.59,17.14 8.64,17.14 6.48,19.3 6.48,21.75 VOUT2.1
PADOUT2: length 29.5
  Top Layer w0.381: VIN1.1 10.41,21.84 13.46,21.84 14.22,22.61 14.22,26.27 R8.2 15.62,27.7 15.62,28.96 17.48,30.81 U1.1
  Top Layer w0.762: R22.2 v1(17.45,16.06)
  Bottom Layer w0.762: VIN1.1 10.03,18.41 15.1,18.41 v1(17.45,16.06)
PADOUT3: length 43.9
  Top Layer w0.381: U1.7 28.37,30.81 29.72,29.46 29.72,27.73 R53.1 31.75,27.69 32.26,27.18 32.26,24.51 31.37,23.62 17.4,23.62 13.72,19.94 VOUT1.1
  Top Layer w0.762: R23.2 20.23,15.71 17.53,18.41 12.96,18.41 12.32,19.05 VOUT1.1
PADOUT4: length 42.9
  Top Layer w0.381: VOUT3.1 12.32,27.68 19.05,34.42 25.78,34.42 26.42,35.05 26.42,36.3 U1.8 28.6,36.35 29.72,37.46 29.72,39.07 R63.2
  Top Layer w0.762: R24.2 v1(23,16.06)
  Bottom Layer w0.762: v1(23,16.06) 20.02,19.05 17.4,19.05 12.7,23.75 VOUT3.1
PADOUT5: length 102.3
  Top Layer w0.762: I_a1.1 31.74,75.56 24.77,75.56 23.82,74.62 U3.7 ; v1(4.83,16.38) 4.83,16.37 R39.2
  Bottom Layer w0.762: v1(4.83,16.38) 2.29,18.92 2.29,69.6 8.38,75.69 31.87,75.69 I_a1.1
PADOUT6: length 134.5
  Top Layer w0.762: v1(5.33,18.16) 7.11,16.38 8.76,16.38 9.13,16.02 R40.2 ; I_b1.1 64.76,75.82 57.72,75.82 57.12,75.21 U4.7
  Bottom Layer w0.762: I_b1.1 61.46,72.52 9.52,72.52 3.68,66.67 3.68,19.81 v1(5.33,18.16)
PADOUT7: length 162.1
  Top Layer w0.762: R41.2 11.9,17.44 11.3,18.03 7.37,18.03 v1(5.33,20.07) ; I_c1.1 95.12,76.71 90.36,76.71 89.38,75.72 U6.7
  Bottom Layer w0.762: I_c1.1 89.15,70.74 11.43,70.74 5.33,64.64 v1(5.33,20.07)
PADOUT8: length 68.3
  Top Layer w0.762: I_in1.1 79.12,25.02 79.12,27.18 80.52,28.57 84.2,28.57 84.73,28.04 U8.7 ; R64.2 v1(25.78,16.06)
  Inner2 w0.762: I_in1.1 78.23,24.89 70.87,17.53 27.25,17.53 v1(25.78,16.06)
PWM1A: length 94
  Top Layer w0.762: 37.52,58.55 36.19,58.55 31.88,62.86 v1(31.88,63.88)
  Bottom Layer w0.762: U7.12 31.32,17.2 27.81,20.7 21.08,20.7 17.53,24.26 17.53,37.46 7.87,47.12 7.87,58.93 12.83,63.88 v1(31.88,63.88)
PWM1B: length 84.1
  Top Layer w0.762: v1(35.56,61.09) IR1.14
  Bottom Layer w0.762: U7.13 33.86,23.55 9.78,47.62 9.78,56.13 9.91,56.26 9.91,58.42 12.57,61.09 v1(35.56,61.09)
PWM2A: length 70.6
  Top Layer w0.762: IR2.12 71.83,58.85 72.64,58.04 72.64,48.26 v1(69.98,45.59)
  Bottom Layer w0.762: v1(69.98,45.59) 55.75,45.59 36.4,26.24 U7.14
PWM2B: length 95
  Top Layer w0.762: IR2.14 72.59,61.39 v1(72.64,61.34)
  Bottom Layer w0.762: v1(72.64,61.34) 86.23,61.34 87.12,60.45 87.12,47.12 84.2,44.2 65.79,44.2 38.94,17.35 U7.15
PWM3A: length 88.5
  Top Layer w0.762: v1(99.44,61.47) 102.11,58.8 IR3.12
  Bottom Layer w0.762: v1(99.44,61.47) 89.66,51.69 89.66,46.86 85.22,42.42 66.8,42.42 41.48,17.09 U7.16
PWM3B: length 84.8
  Top Layer w0.762: v1(101.35,61.34) 103.68,61.34
  Bottom Layer w0.762: v1(101.35,61.34) 91.82,51.82 91.82,45.97 86.11,40.26 68.2,40.26 44.02,16.08 U7.17
REF_1V65: length 44.9
  Top Layer w0.762: R26.2 R25.1 ; v1(28.83,21.97) 32.26,21.97 34.16,23.88 v1(34.16,28.83) ; R52.2 v1(22.73,27.69) R49.1
  Bottom Layer w0.762: 28.58,22.1 v1(22.73,22.1) v1(22.73,27.69) ; v1(23.82,39.12) 29.59,39.12 34.16,34.54 v1(34.16,28.83)
SPWMH1: length 6.3
  Top Layer w0.762: IR1.8 26.4,54.74 25.91,54.25 R20.1 24.16,53.17 R13.1
SPWMH2: length 6.5
  Top Layer w0.762: IR2.8 59.24,55.04 58.8,54.61 58.8,53.48 R66.1 57.12,53.35 R15.1
SPWMH3: length 6.3
  Top Layer w0.762: IR3.8 92.45,54.99 91.68,54.21 R68.1 90.04,53.32 R42.1
SPWML1: length 6.3
  Top Layer w0.762: 28.02,63.63 26.42,63.63 25.91,64.13 R65.1 23.75,65.42 R14.1
SPWML2: length 5.7
  Top Layer w0.762: R16.1 57.02,65.55 R67.1 60.29,63.93 IR2.1
SPWML3: length 5.6
  Top Layer w0.762: IR3.1 93.22,63.88 R69.1 89.79,65.42 R43.1
VOUT: length 55.8
  Top Layer w1.524: 90.06,44.61 C117.2 C116.2 90.06,37.61 v2(90.04,37.59)
  Bottom Layer w1.524: U9.6 120.65,37.97 118.24,35.56 92.07,35.56 v2(90.04,37.59)
$1N217: length 7
  Top Layer w0.381: U1.3 21.38,29.89 19.51,28.02 R49.2 21.51,25.69 R47.2
$1N317: length 7.1
  Top Layer w0.381: R46.2 R8.1 17.65,27.7 17.65,28.83 18.16,29.34 19.3,29.34 20.11,30.14 U1.2
$1N465: length 7
  Top Layer w0.381: R51.2 25.89,27.4 R52.1 25.27,28.45 23.92,29.8 U1.5
$1N509: length 7.2
  Top Layer w0.381: R50.2 27.82,27.63 R53.2 27.76,28.37 27.05,29.08 25.91,29.08 25.19,29.8 U1.6
$1N654: length 5.8
  Top Layer w0.381: U1.12 21.38,37.24 R58.2 R56.2
$1N682: length 7
  Top Layer w0.381: U1.13 20.07,36.39 20.07,37.34 19.56,37.85 18.03,37.85 17.64,38.24 R60.1 R59.2
$1N827: length 5.9
  Top Layer w0.381: R57.2 R61.2 25.89,39.1 23.92,37.13 U1.10
$1N856: length 7
  Top Layer w0.381: R62.2 27.76,41.34 R63.1 27.76,38.3 27.3,37.85 25.91,37.85 25.19,37.13 U1.9
$1N4259: length 7.4
  Top Layer w0.762: D1.1 21.11,57.17 C42.1 25.54,56.01 IR1.7
$1N4274: length 7.4
  Top Layer w0.762: IR2.7 58.51,56.31 C43.1 54.35,57.29 D2.1
$1N4289: length 7.4
  Top Layer w0.762: IR3.7 91.46,56.26 C52.1 90.42,57.03 D5.1
$1N4373: length 2
  Top Layer w0.762: R20.2 24.33,51.17 D12.2
$1N4452: length 1.9
  Top Layer w0.762: D13.2 25.8,67.31 R65.2
$1N4604: length 1.7
  Top Layer w0.762: R66.2 57.07,51.35 D14.2
$1N4683: length 1.8
  Top Layer w0.762: R67.2 58.53,67.69 D15.2
$1N4762: length 1.7
  Top Layer w0.762: R68.2 91.66,51.31 D16.2
$1N4841: length 1.7
  Top Layer w0.762: D17.2 90.02,67.42 R69.2
$1N5237: length 2.5
  Top Layer w0.762: R17.1 66.97,18.67 66.88,18.76
$1N5238: length 2.3
  Top Layer w0.762: R18.1 54.98,18.67 54.89,18.76
$1N5239: length 2.4
  Top Layer w0.762: R19.1 43.1,18.67 43,18.76

## Copper pours and planes (outline as drawn; the poured copper is in the pictures)
+5V on Top Layer: 61.22,11.56 67.94,11.56 67.94,3.8 61.22,3.8
+5V on Top Layer: 5.38,46 8.51,46 8.51,31.75 5.38,31.75
+12V on Top Layer: 44.12,46.48 50.16,46.48 50.16,28.03 44.12,28.03
GND on Top Layer: 52.96,11.56 62.61,11.56 62.61,3.94 52.96,3.94
GND on GND1: 0.26,111.88 122.93,111.88 122.93,0.26 0.26,0.26
GND on Inner2: -2.79,115.82 126.11,115.82 126.11,-2.67 -2.79,-2.67
GND on GND: 0.26,111.88 122.93,111.88 122.93,0.26 0.26,0.26
PGND on Top Layer: 90.97,107.73 119.39,107.73 119.39,35.04 90.97,35.04
PGND on Top Layer: 8.51,95.76 22.1,95.76 22.1,72.9 8.51,72.9
PGND on Top Layer: 41.59,95.63 55.05,95.63 55.05,73.91 41.59,73.91
PGND on Top Layer: 74.42,96.02 88.01,96.02 88.01,74.3 74.42,74.3
PGND on PGND: 0.26,111.88 122.93,111.88 122.93,0.26 0.26,0.26
VIN on Top Layer: 74.24,55.78 84.26,55.78 84.26,30.83 74.24,30.83
VIN on Top Layer: 41.06,55.5 51.31,55.5 51.31,48.41 41.06,48.41
VIN on Top Layer: 7.93,55.72 18.33,55.72 18.33,48.61 7.93,48.61
VIN on Bottom Layer: 11.56,58.8 84.33,58.8 84.33,48.39 11.56,48.39
+DC on Top Layer: 101.73,33.78 117.47,33.78 117.47,27.56 101.73,27.56
+DC on Top Layer: 84.45,34.07 86.61,34.07 86.61,30.73 84.45,30.73
+DC on Top Layer: 84.45,45.77 101.47,45.77 101.47,31.75 84.45,31.75
IOUT1 on Top Layer: 10.16,107.76 28.83,107.76 28.83,77.85 10.16,77.85
IOUT2 on Top Layer: 43.5,108.17 62.17,108.17 62.17,78.26 43.5,78.26
IOUT3 on Top Layer: 75.37,99.6 94.42,99.6 94.42,78.77 75.37,78.77
IOUT3 on Top Layer: 71.88,107.82 82.55,107.82 82.55,98.28 71.88,98.28
IOUT_1 on Top Layer: 18.67,81.41 22.86,81.41 22.86,77.98 18.67,77.98
IOUT_1 on Bottom Layer: 18.67,107.7 32.98,107.7 32.98,77.85 18.67,77.85
IOUT_2 on Top Layer: 51.97,81.66 56.16,81.66 56.16,78.23 51.97,78.23
IOUT_2 on Bottom Layer: 51.94,108.15 70.61,108.15 70.61,78.36 51.94,78.36
IOUT_3 on Top Layer: 84.23,82.17 88.42,82.17 88.42,78.74 84.23,78.74
IOUT_3 on Bottom Layer: 81.41,107.72 98.68,107.72 98.68,78.74 81.41,78.74
OUT1 on Top Layer: 1.91,107.72 18.03,107.72 18.03,56.21 1.91,56.21
OUT2 on Top Layer: 33.89,107.84 51.18,107.84 51.18,55.37 33.89,55.37
OUT3 on Top Layer: 62.36,107.95 70.74,107.95 70.74,96.77 62.36,96.77
OUT3 on Top Layer: 64.33,98.28 84.07,98.28 84.07,55.59 64.33,55.59
VA on Top Layer: 91.44,46.23 96.14,46.23 96.14,40.71 91.44,40.71
GND on Top Layer: 0.76,46.1 0.99,46.64 1.52,46.86 60.68,46.86 60.98,46.81 61.22,46.64 78.9,28.97 79.15,28.8 79.44,28.74 85.62,28.74 85.91,28.68 86.16,28.52 95.41,19.27 95.66,19.11 95.95,19.05 116.71,19.05 117.25,18.83 117.47,18.29 117.47,0.63 117.35,0.51 8.57,0.51 8.28,0.57 8.03,0.73 0.98,7.78 0.82,8.03 0.76,8.32
GND on Bottom Layer: 0.76,46.1 0.99,46.64 1.52,46.86 60.68,46.86 60.98,46.81 61.22,46.64 78.9,28.97 79.15,28.8 79.44,28.74 85.62,28.74 85.91,28.68 86.16,28.52 95.41,19.27 95.66,19.11 95.95,19.05 116.71,19.05 117.25,18.83 117.47,18.29 117.47,0.63 117.35,0.51 8.57,0.51 8.28,0.57 8.03,0.73 0.98,7.78 0.82,8.03 0.76,8.32
+DC on Top Layer: 119.38,29.35 119.38,32.2 119.16,32.74 118.62,32.96 107.18,32.96 106.89,33.02 106.64,33.19 106.01,33.81 105.77,33.98 105.48,34.04 85.34,34.05 84.81,33.83 84.58,33.29 84.58,31.59 84.81,31.05 85.34,30.83 88.11,30.83 88.4,30.77 88.65,30.61 94.9,24.35 95.06,24.11 95.12,23.81 95.12,22.86 95.35,22.32 95.88,22.1 118.62,22.1 119.16,22.32 119.38,22.86 119.38,29.35

Small or netless copper shapes (teardrops, artwork), in the pictures only: 48 on GND1, 60 on PGND, 48 on GND

## Text on the board
Bottom Silkscreen Layer: A相 | B相 | C相
Top Silkscreen Layer: 5V辅助 | PGND | DC+
